# EAGLE design sensors (EAGLE 7.7.0)
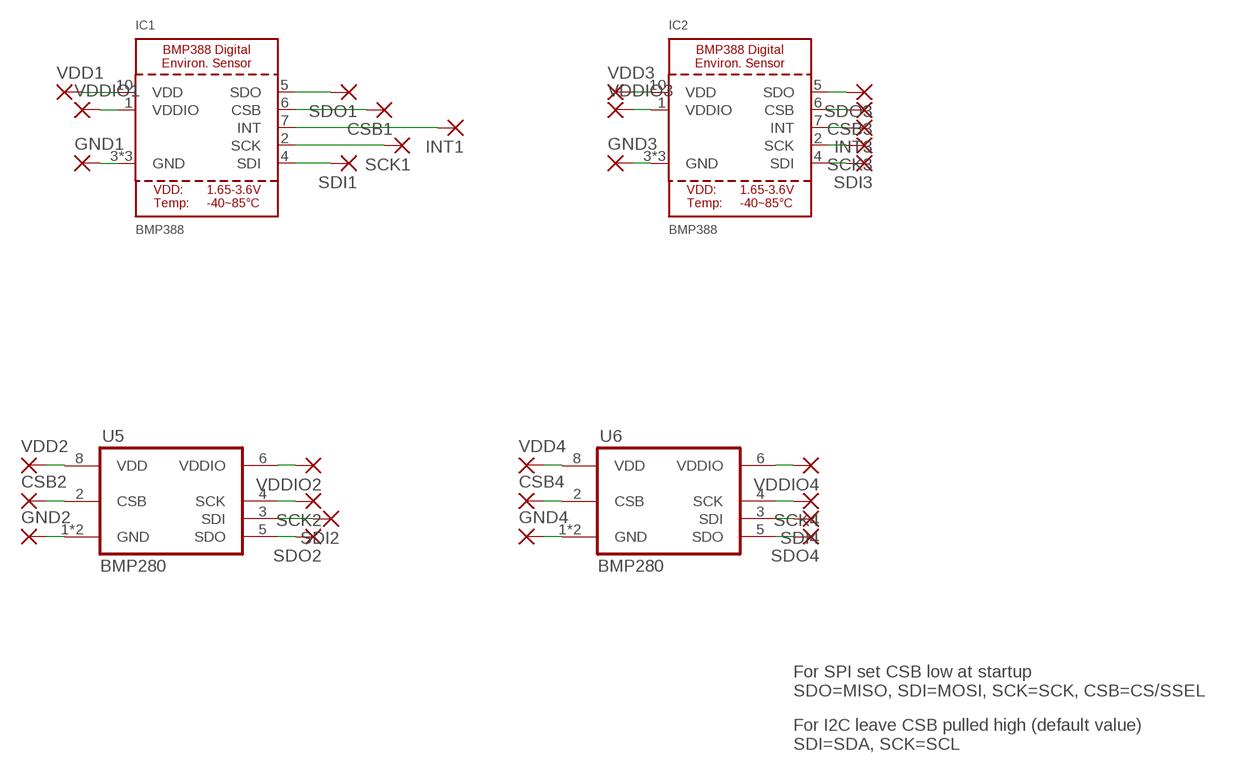
[diagram p0: schematic, sheet 1]

## Parts
CSB1  SMD5  [SMD2,54-5,08]
CSB2  SMD5  [SMD2,54-5,08]
CSB3  SMD5  [SMD2,54-5,08]
CSB4  SMD5  [SMD2,54-5,08]
GND1  SMD5  [SMD2,54-5,08]
GND2  SMD5  [SMD2,54-5,08]
GND3  SMD5  [SMD2,54-5,08]
GND4  SMD5  [SMD2,54-5,08]
IC1  BMP388  [BMP388]
IC2  BMP388  [BMP388]
INT1  SMD5  [SMD2,54-5,08]
INT3  SMD5  [SMD2,54-5,08]
SCK1  SMD5  [SMD2,54-5,08]
SCK2  SMD5  [SMD2,54-5,08]
SCK3  SMD5  [SMD2,54-5,08]
SCK4  SMD5  [SMD2,54-5,08]
SDI1  SMD5  [SMD2,54-5,08]
SDI2  SMD5  [SMD2,54-5,08]
SDI3  SMD5  [SMD2,54-5,08]
SDI4  SMD5  [SMD2,54-5,08]
SDO1  SMD5  [SMD2,54-5,08]
SDO2  SMD5  [SMD2,54-5,08]
SDO3  SMD5  [SMD2,54-5,08]
SDO4  SMD5  [SMD2,54-5,08]
U5  BMP280  [BMP280]
U6  BMP280  [BMP280]
VDD1  SMD5  [SMD2,54-5,08]
VDD2  SMD5  [SMD2,54-5,08]
VDD3  SMD5  [SMD2,54-5,08]
VDD4  SMD5  [SMD2,54-5,08]
VDDIO1  SMD5  [SMD2,54-5,08]
VDDIO2  SMD5  [SMD2,54-5,08]
VDDIO3  SMD5  [SMD2,54-5,08]
VDDIO4  SMD5  [SMD2,54-5,08]

## Nets
N$1: IC1.10(VDD) VDD1.1(P)
N$2: IC1.1(VDDIO) VDDIO1.1(P)
N$3: GND1.1(P) IC1.3(GND) IC1.8(GND) IC1.9(GND)
N$4: IC1.5(SDO) SDO1.1(P)
N$5: CSB1.1(P) IC1.6(CSB)
N$6: IC1.7(INT) INT1.1(P)
N$7: IC1.2(SCK) SCK1.1(P)
N$8: IC1.4(SDI) SDI1.1(P)
N$9: U5.8(VDD) VDD2.1(P)
N$10: CSB2.1(P) U5.2(CSB)
N$11: GND2.1(P) U5.1(GND) U5.7(GND)
N$12: U5.6(VDDIO) VDDIO2.1(P)
N$13: SCK2.1(P) U5.4(SCK)
N$14: SDI2.1(P) U5.3(SDI)
N$15: SDO2.1(P) U5.5(SDO)
N$16: IC2.10(VDD) VDD3.1(P)
N$17: IC2.1(VDDIO) VDDIO3.1(P)
N$18: GND3.1(P) IC2.3(GND) IC2.8(GND) IC2.9(GND)
N$19: IC2.5(SDO) SDO3.1(P)
N$20: CSB3.1(P) IC2.6(CSB)
N$21: IC2.7(INT) INT3.1(P)
N$22: IC2.2(SCK) SCK3.1(P)
N$23: IC2.4(SDI) SDI3.1(P)
N$24: U6.6(VDDIO) VDDIO4.1(P)
N$25: SCK4.1(P) U6.4(SCK)
N$26: SDI4.1(P) U6.3(SDI)
N$27: SDO4.1(P) U6.5(SDO)
N$28: GND4.1(P) U6.1(GND) U6.7(GND)
N$29: CSB4.1(P) U6.2(CSB)
N$30: U6.8(VDD) VDD4.1(P)

## Notes on the sheet
- For SPI set CSB low at startup
  SDO=MISO, SDI=MOSI, SCK=SCK, CSB=CS/SSEL
- For I2C leave CSB pulled high (default value)
  SDI=SDA, SCK=SCL

## Library data of the parts
CSB1-CSB4 GND1-GND4 INT1 INT3 SCK1-SCK4 SDI1-SDI4 SDO1-SDO4 VDD1-VDD4 VDDIO1-VDDIO4 = wirepad:SMD5: SMD PAD
IC1 IC2 = microbuilder:BMP388; MPN: BMP388
U5 U6 = bosch-bmp280:BMP280: The BMP280 is an absolute barometric pressure sensor especially designed for mobile applications. The sensor module is housed in an extremely compact 8-pin metal-lid LGA package with a footprint of only 2.0 × 2.5 mm2 and 0.95 mm package height. Its small dimensions and its low power consumption of 2.7 μA @1Hz allow the implementation in battery driven devices such as mobile phones, GPS modules or watches. The library has been designed by Richard Magdycz <https://www.facebook.com/groups/eaglecadsoftUK>; MPN: BMP280

## Board
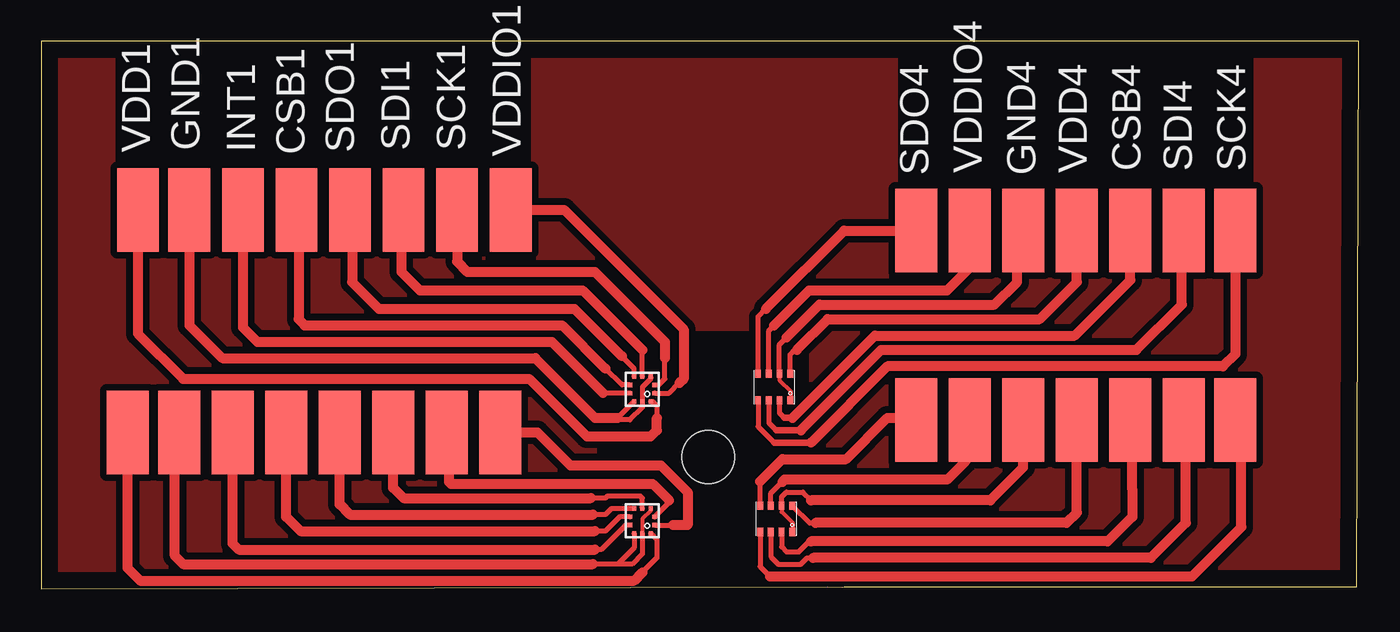
[diagram p1: board, top side]

Size 80 x 33.25 mm. Coordinates in mm from the lower left corner, seen from the top.
Outline: 0,33.25 0,0 47.73,0.12 48.62,0.1 48.75,0.12 79.88,0.12 80,33.25 0,33.25
Copper layers (1*16): Top 0.035mm / dielectric 1.5mm / Bottom 0.035mm
Design rules "default *": minimum track width 0.24891875mm, minimum drill 24mil, track to track 16mil, track to pad 16mil, pad to pad 8mil, via to via 8mil, smd to smd 8mil, copper to edge 40mil, drill to drill 10mil, minimum pad ring 10mil, minimum via ring 8mil, stop-mask expansion 4mil, vias tented up to drill 0mil, thermal gap 10mil
Holes 3.2 mm at 40.5,8
vRestrict: area 33.4,2.9 to 35.9,5.4; area 41.4,2.9 to 43.9,5.4; area 33.4,10.9 to 35.9,13.4; area 41.4,10.9 to 43.9,13.4

### Footprints (pad centres in the part's own frame; a part is rotated, then mirrored left to right if it is on the bottom)
SMD2,54-5,08 = smd 2.54 x 5.08: 1 0,0
BMP388 = smd 0.25 x 0.275: 1 0.25,0.75; 2 -0.25,0.75; 6 -0.25,-0.75; 7 0.25,-0.75 | smd 0.275 x 0.25: 3 -0.762,0.5; 4 -0.762,0; 5 -0.762,-0.5; 8 0.762,-0.5; 9 0.762,0; 10 0.762,0.5
BMP280 = smd 0.35 x 0.5: 1 0.975,-0.8; 2 0.325,-0.8; 3 -0.325,-0.8; 4 -0.975,-0.8; 5 -0.975,0.8; 6 -0.325,0.8; 7 0.325,0.8; 8 0.975,0.8

### Placement (x,y rotation side)
CSB1  15.5,23 180 top
CSB2  66.12,10.25 0 top
CSB3  14.88,9.5 0 top
CSB4  66.12,21.75 180 top
GND1  9,23 0 top
GND2  59.62,10.25 0 top
GND3  8.38,9.5 180 top
GND4  59.62,21.75 0 top
IC1  36.5,12.12 270 top
IC2  36.5,4.12 270 top
INT1  12.25,23 0 top
INT3  11.62,9.5 0 top
SCK1  25.25,23 0 top
SCK2  72.5,10.25 0 top
SCK3  24.62,9.5 0 top
SCK4  72.5,21.75 180 top
SDI1  22,23 0 top
SDI2  69.38,10.25 0 top
SDI3  21.38,9.5 0 top
SDI4  69.38,21.75 180 top
SDO1  18.75,23 180 top
SDO2  53.12,10.25 0 top
SDO3  18.12,9.5 0 top
SDO4  53.12,21.75 0 top
U5  44.62,4.25 0 top
U6  44.5,12.25 0 top
VDD1  5.88,23 180 top
VDD2  62.88,10.25 0 top
VDD3  5.25,9.5 180 top
VDD4  62.88,21.75 0 top
VDDIO1  28.5,23 180 top
VDDIO2  56.38,10.25 0 top
VDDIO3  27.88,9.5 0 top
VDDIO4  56.38,21.75 0 top

### Tracks (layer width: path | path; a pad name or v marks a point on that pad's centre or on a via)
N$1
  Top 0.305: IC1.10 37.14,11.36 37.38,11.12 37.38,10.38
  Top 0.61: VDD1.1 5.88,15.5 8.62,12.75 29.62,12.75 33.12,9.25 37,9.25 37.38,9.62 37.38,10.38
N$2
  Top 0.305: IC1.1 38.12,11.88 38.75,12.5
  Top 0.61: 38.75,12.5 39,12.75 39,15.75 31.75,23 VDDIO1.1
N$3
  Top 0.305: IC1.8 35.99,11.36 35,10.38 | 34.88,10.38 35,10.25 35.75,10.25 36.5,11 IC1.9 36.5,12.25 37,12.75 IC1.3
  Top 0.61: GND1.1 9,16 11,14 30,14 33.62,10.38 34.88,10.38 35,10.38
N$4
  Top 0.254: 18.88,22.88 SDO1.1
  Top 0.305: IC1.5 36,13.38 35.25,14.12
  Top 0.61: 18.88,22.88 18.88,18.62 20.5,17 32.38,17 35.25,14.12
N$5
  Top 0.254: 15.62,22.88 CSB1.1
  Top 0.305: IC1.6 35.25,12.38 34.25,13.38
  Top 0.61: 15.62,22.88 15.62,16.38 16,16 31.62,16 34.25,13.38
N$6
  Top 0.305: IC1.7 34.12,11.88
  Top 0.61: INT1.1 12.25,15.88 13.12,15 31,15 34.12,11.88
N$7
  Top 0.305: IC1.2 37.5,12.38 37.88,12.75 37.88,14
  Top 0.61: SCK1.1 25.25,19.88 25.88,19.25 33.62,19.25 37.88,15 37.88,14
N$8
  Top 0.254: 21.88,22.88 SDI1.1
  Top 0.305: IC1.4 36.5,14.5
  Top 0.61: 21.88,22.88 21.88,19.25 23,18.12 32.88,18.12 36.5,14.5
N$9
  Top 0.305: U5.8 46.65,4 47,4
  Top 0.61: VDD2.1 62.88,4.62 62.25,4 47,4
N$10
  Top 0.254: 66.25,5.88 66.25,6 | 66.25,10.12 CSB2.1
  Top 0.305: U5.2 44.95,2.55 45.25,2.25 46,2.25 46.62,2.88 46.75,2.88
  Top 0.61: 66.25,10.12 66.25,6 66.25,4.38 64.75,2.88 46.75,2.88
N$11
  Top 0.254: U5.7 44.95,4.67 45.62,4 45.62,3.48 U5.1
  Top 0.305: 46.75,5.38 46.25,5.88 45.25,5.88 44.95,5.58 U5.7
  Top 0.61: GND2.1 59.62,7.38 57.62,5.38 46.75,5.38
N$12
  Top 0.254: 56.12,7.75 56.12,10 VDDIO2.1
  Top 0.305: U5.6 44.3,5.8 45,6.5
  Top 0.61: 56.12,7.75 55,6.62 45.12,6.62 45,6.5
N$13
  Top 0.254: 72.88,9.88 SCK2.1
  Top 0.305: U5.4 43.65,1.35 44.25,0.75
  Top 0.61: 72.88,9.88 72.88,3.75 69.88,0.75 44.25,0.75
N$14
  Top 0.254: 69.5,10.12 SDI2.1
  Top 0.305: 46.88,1.88 46.5,1.88 46.12,1.5 44.75,1.5 44.3,1.95 U5.3
  Top 0.61: 69.5,10.12 69.5,4 67.38,1.88 46.88,1.88
N$15
  Top 0.254: 53,10.38 SDO2.1
  Top 0.305: U5.5 43.65,6.53
  Top 0.61: 43.65,6.53 45,7.88 48.88,7.88 51.38,10.38 53,10.38
N$16
  Top 0.305: IC2.10 37.38,2.99 37.38,1.88 36.5,1
  Top 0.61: VDD3.1 5.25,1.25 6,0.5 36,0.5 36.5,1
N$17
  Top 0.305: IC2.1 38.38,3.88
  Top 0.61: VDDIO3.1 30.12,9.5 32.12,7.5 37.62,7.5 39.25,5.88 39.25,3.88 38.38,3.88
N$18
  Top 0.254: 8.12,9 8.38,9.25 GND3.1 | IC2.3 37,4.75 36.5,4.25 IC2.9
  Top 0.305: IC2.8 36,2.5 35,1.5 | 35,1.5 33.5,1.5 | IC2.9 36.5,2.12 35.88,1.5 35,1.5
  Top 0.61: 8.12,9 8.12,2 8.62,1.5 33.5,1.5
N$19
  Top 0.254: IC2.5 35.99,4.88
  Top 0.305: 35.99,4.88 34.62,4.88 34.25,4.5 33.5,4.5
  Top 0.61: SDO3.1 18.12,5.12 18.75,4.5 33.5,4.5
N$20
  Top 0.305: IC2.6 35.12,4.38 34.25,3.5 33.62,3.5
  Top 0.61: CSB3.1 14.88,4.38 15.75,3.5 33.62,3.5
N$21
  Top 0.305: IC2.7 35.5,3.88 34,2.38 33.62,2.38
  Top 0.61: INT3.1 11.62,2.75 12,2.38 33.62,2.38
N$22
  Top 0.254: SCK3.1 24.75,9.38
  Top 0.305: IC2.2 38.12,5.25 38.12,5.38
  Top 0.61: 24.75,9.38 24.75,6.5 24.88,6.38 37.12,6.38 38.12,5.38
N$23
  Top 0.305: IC2.4 36.5,5.5 36.38,5.62 34.38,5.62 34.25,5.5 33.38,5.5
  Top 0.61: SDI3.1 21.38,6.12 22,5.5 33.38,5.5
N$24
  Top 0.254: 56.38,19.5 VDDIO4.1
  Top 0.305: U6.6 44.17,15.68 44.5,16
  Top 0.61: 56.38,19.5 55,18.12 46.62,18.12 44.5,16
N$25
  Top 0.305: U6.4 43.52,9.85 44.5,8.88
  Top 0.406: 46.75,8.88 44.5,8.88
  Top 0.61: SCK4.1 72.5,14.25 71.75,13.5 51.38,13.5 46.75,8.88
N$26
  Top 0.254: 69.25,21.62 SDI4.1
  Top 0.305: U6.3 44.17,10.07 44.62,9.62
  Top 0.406: 44.62,9.62 46.12,9.62
  Top 0.61: 46.12,9.62 51,14.5 66.5,14.5 69.25,17.25 69.25,21.62
N$27
  Top 0.305: U6.5 43.52,16.52 44,17
  Top 0.61: SDO4.1 48.75,21.75 44,17
N$28
  Top 0.254: 59.25,21.38 GND4.1 | U6.1 45.5,11.47 45.5,12 44.83,12.68 U6.7
  Top 0.305: U6.7 44.83,14.82 45.25,15.25
  Top 0.61: 59.25,21.38 59.25,18.62 57.88,17.25 47.25,17.25 45.25,15.25
N$29
  Top 0.305: U6.2 44.83,10.68 45.12,10.38
  Top 0.406: 45.12,10.38 45.62,10.38
  Top 0.61: CSB4.1 66.12,18.75 62.75,15.38 50.62,15.38 45.62,10.38
N$30
  Top 0.305: U6.8 45.48,14.22 45.75,14.5 45.88,14.5
  Top 0.61: VDD4.1 62.88,18.62 60.62,16.38 47.75,16.38 45.88,14.5
PLANE
  pour Top: 0,33.12 4.38,33.12 4.38,25.75 29.88,25.62 29.88,33 51.88,33 51.88,24.38 73.75,24.38 73.75,33.25 80,33.38 80,0.25 46.75,0.12 46.75,15.75 33.62,15.75 33.62,0 0,0

### Text on the board
bNames: (c) 2020 Steven Carr / & Daren Schwenke | VISP-DUAL-I2C | VISP-DUAL-I2C